# EAGLE schematic sampling-tracker (EAGLE 9.4.1)
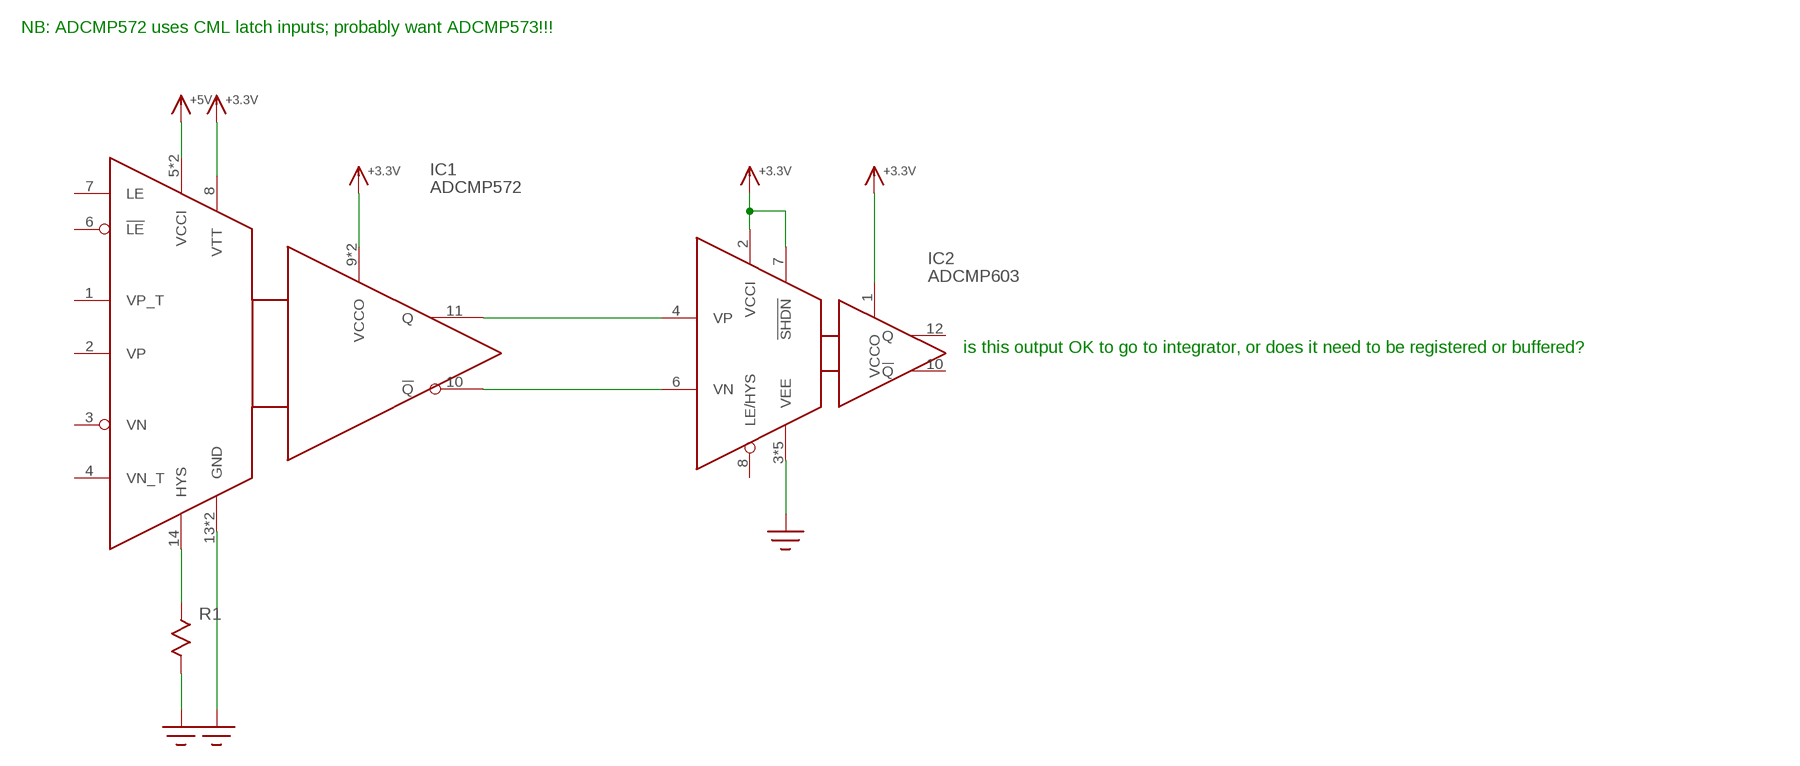
[diagram p0: schematic, sheet 1]

## Parts
IC1  ADCMP572  [TQFN16-EP]
IC2  ADCMP603  [QFN12-3X3]
R1  R0603  [R0603]

## Nets
+3.3V: IC1.8(VTT) IC1.9(VCCO) IC1.12(VCCO) IC2.2(VCCI) IC2.7(!SHDN!)
+5V: IC1.5(VCCI) IC1.16(VCCI)
GND: IC1.13(GND) IC1.15(GND) IC2.3(VEE) IC2.5(VEE) IC2.9(VEE) IC2.11(VEE) IC2.EP(VEE) R1.P$2
N$1: IC1.14(HYS) R1.P$1
N$2: IC1.11(Q) IC2.4(VP)
N$3: IC1.10(!Q!) IC2.6(VN)
N$4: IC2.1(VCCO) ; supply symbol labelled +3.3V
Unconnected: IC1.1(VP_T) IC1.2(VP) IC1.3(VN) IC1.4(VN_T) IC1.6(!LE!) IC1.7(LE) IC2.8(LE/HYS) IC2.10(!Q!) IC2.12(Q)

## Notes on the sheet
- NB: ADCMP572 uses CML latch inputs; probably want ADCMP573!!!
- is this output OK to go to integrator, or does it need to be registered or buffered?

## Library data of the parts
IC1 = yapo:ADCMP572
IC2 = yapo:ADCMP603
R1 = yapo:R